# Altium project 1XGSH00.PrjPCB
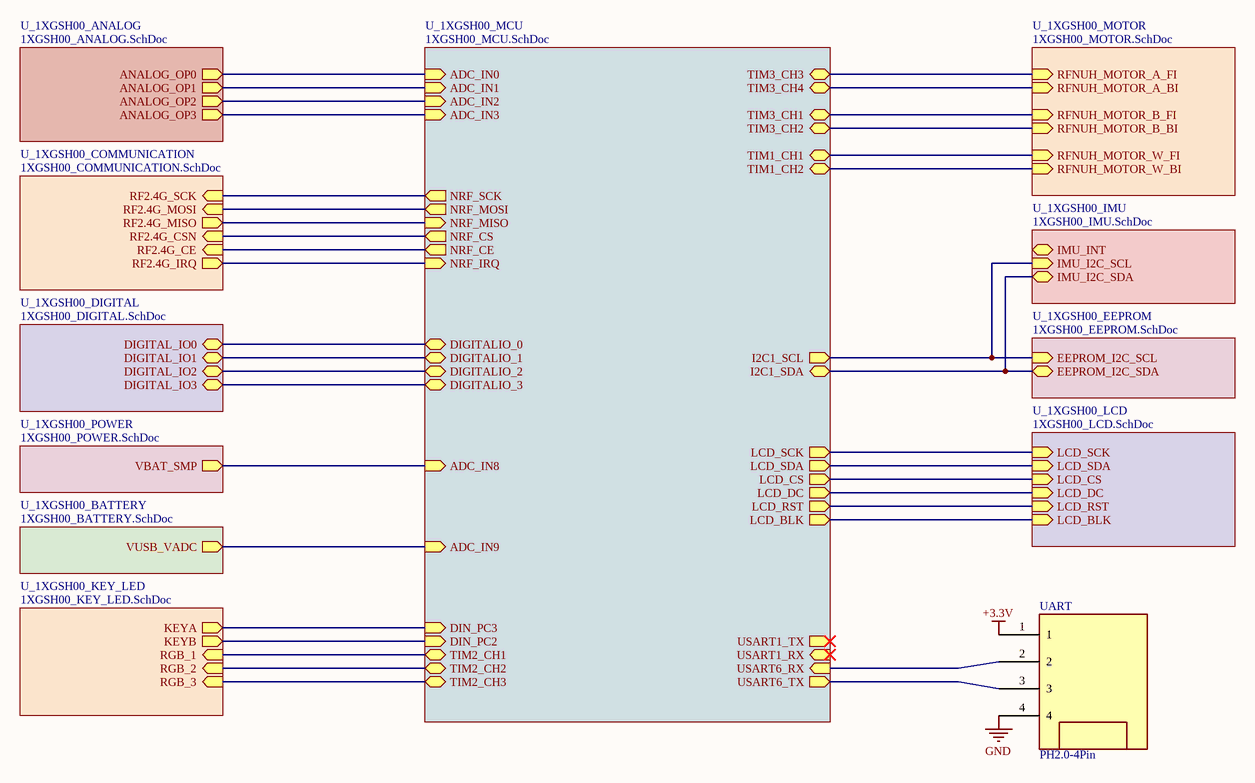
[diagram p0: 1XGSH00.SchDoc]
12 sheets, 178 parts. Net scope: hierarchical (ports join the sheet entries above them; power ports are global).
Board file: Copy of 1XGSH00_197.PcbDoc
Sheets:
  1XGSH00.SchDoc
    U_1XGSH00_ANALOG = 1XGSH00_ANALOG.SchDoc
    U_1XGSH00_BATTERY = 1XGSH00_BATTERY.SchDoc
    U_1XGSH00_COMMUNICATION = 1XGSH00_COMMUNICATION.SchDoc
    U_1XGSH00_DIGITAL = 1XGSH00_DIGITAL.SchDoc
    U_1XGSH00_MCU = 1XGSH00_MCU.SchDoc
    U_1XGSH00_POWER = 1XGSH00_POWER.SchDoc
    U_1XGSH00_MOTOR = 1XGSH00_MOTOR.SchDoc
    U_1XGSH00_IMU = 1XGSH00_IMU.SchDoc
    U_1XGSH00_EEPROM = 1XGSH00_EEPROM.SchDoc
    U_1XGSH00_KEY_LED = 1XGSH00_KEY_LED.SchDoc
    U_1XGSH00_LCD = 1XGSH00_LCD.SchDoc

## Sheet 1XGSH00.SchDoc
size A4

### Parts
UART  PH2.0-4Pin  [X1251WRS-04HF-LPSW]

### Sub-sheets
U_1XGSH00_ANALOG = 1XGSH00_ANALOG.SchDoc: ANALOG_OP0 (out), ANALOG_OP2 (out), ANALOG_OP3 (out), ANALOG_OP1 (out)
U_1XGSH00_BATTERY = 1XGSH00_BATTERY.SchDoc: VUSB_VADC (out)
U_1XGSH00_COMMUNICATION = 1XGSH00_COMMUNICATION.SchDoc: RF2.4G_SCK (in), RF2.4G_IRQ (out), RF2.4G_CE (in), RF2.4G_MISO (out), RF2.4G_MOSI (in), RF2.4G_CSN (in)
U_1XGSH00_DIGITAL = 1XGSH00_DIGITAL.SchDoc: DIGITAL_IO0 (bidir), DIGITAL_IO1 (bidir), DIGITAL_IO2 (bidir), DIGITAL_IO3 (bidir)
U_1XGSH00_EEPROM = 1XGSH00_EEPROM.SchDoc: EEPROM_I2C_SCL (in), EEPROM_I2C_SDA (bidir)
U_1XGSH00_IMU = 1XGSH00_IMU.SchDoc: IMU_I2C_SDA (bidir), IMU_I2C_SCL (in), IMU_INT (bidir)
U_1XGSH00_KEY_LED = 1XGSH00_KEY_LED.SchDoc: KEYA (out), KEYB (out), RGB_1 (in), RGB_2 (in), RGB_3 (in)
U_1XGSH00_LCD = 1XGSH00_LCD.SchDoc: LCD_SCK (in), LCD_SDA (in), LCD_DC (in), LCD_CS (in), LCD_RST (in), LCD_BLK (in)
U_1XGSH00_MCU = 1XGSH00_MCU.SchDoc: DIGITALIO_2 (bidir), DIGITALIO_3 (bidir), DIGITALIO_0 (bidir), DIGITALIO_1 (bidir), LCD_SCK (out), LCD_DC (out), LCD_BLK (out), LCD_SDA (out), LCD_CS (out), LCD_RST (out), TIM3_CH1 (bidir), ADC_IN8 (in), ADC_IN2 (in), NRF_CS (out), NRF_MISO (in), USART6_TX (out), TIM3_CH4 (bidir), USART1_RX (in), USART1_TX (out), TIM3_CH2 (bidir), TIM1_CH2 (bidir), TIM1_CH1 (bidir), I2C1_SCL (out), I2C1_SDA (bidir), ADC_IN3 (in), USART6_RX (in), TIM3_CH3 (bidir), TIM2_CH2 (bidir), NRF_CE (out), ADC_IN1 (in), NRF_IRQ (in), ADC_IN0 (in), NRF_SCK (out), NRF_MOSI (out), ADC_IN9 (in), TIM2_CH1 (bidir), TIM2_CH3 (bidir), DIN_PC2 (in), DIN_PC3 (in)
U_1XGSH00_MOTOR = 1XGSH00_MOTOR.SchDoc: RFNUH_MOTOR_W_BI (in), RFNUH_MOTOR_B_FI (in), RFNUH_MOTOR_A_FI (in), RFNUH_MOTOR_A_BI (in), RFNUH_MOTOR_W_FI (in), RFNUH_MOTOR_B_BI (in)
U_1XGSH00_POWER = 1XGSH00_POWER.SchDoc: VBAT_SMP (out)

### Nets
+3.3V: UART.1
GND: UART.4
I2C_SCL: sheet U_1XGSH00_MCU/I2C1_SCL, sheet U_1XGSH00_IMU/IMU_I2C_SCL, sheet U_1XGSH00_EEPROM/EEPROM_I2C_SCL
I2C_SDA: sheet U_1XGSH00_MCU/I2C1_SDA, sheet U_1XGSH00_IMU/IMU_I2C_SDA, sheet U_1XGSH00_EEPROM/EEPROM_I2C_SDA
MABI: sheet U_1XGSH00_MCU/TIM3_CH4, sheet U_1XGSH00_MOTOR/RFNUH_MOTOR_A_BI
MAFI: sheet U_1XGSH00_MCU/TIM3_CH3, sheet U_1XGSH00_MOTOR/RFNUH_MOTOR_A_FI
MBBI: sheet U_1XGSH00_MCU/TIM3_CH2, sheet U_1XGSH00_MOTOR/RFNUH_MOTOR_B_BI
MBFI: sheet U_1XGSH00_MCU/TIM3_CH1, sheet U_1XGSH00_MOTOR/RFNUH_MOTOR_B_FI
MCU_ADC0: sheet U_1XGSH00_ANALOG/ANALOG_OP0, sheet U_1XGSH00_MCU/ADC_IN0
MCU_ADC1: sheet U_1XGSH00_ANALOG/ANALOG_OP1, sheet U_1XGSH00_MCU/ADC_IN1
MCU_ADC2: sheet U_1XGSH00_ANALOG/ANALOG_OP2, sheet U_1XGSH00_MCU/ADC_IN2
MCU_ADC3: sheet U_1XGSH00_ANALOG/ANALOG_OP3, sheet U_1XGSH00_MCU/ADC_IN3
MWBI: sheet U_1XGSH00_MCU/TIM1_CH2, sheet U_1XGSH00_MOTOR/RFNUH_MOTOR_W_BI
MWFI: sheet U_1XGSH00_MCU/TIM1_CH1, sheet U_1XGSH00_MOTOR/RFNUH_MOTOR_W_FI
RF_CE: sheet U_1XGSH00_COMMUNICATION/RF2.4G_CE, sheet U_1XGSH00_MCU/NRF_CE
RF_IRQ: sheet U_1XGSH00_COMMUNICATION/RF2.4G_IRQ, sheet U_1XGSH00_MCU/NRF_IRQ
SPI_CLK: sheet U_1XGSH00_COMMUNICATION/RF2.4G_SCK, sheet U_1XGSH00_MCU/NRF_SCK
SPI_CS: sheet U_1XGSH00_COMMUNICATION/RF2.4G_CSN, sheet U_1XGSH00_MCU/NRF_CS
SPI_MISO: sheet U_1XGSH00_COMMUNICATION/RF2.4G_MISO, sheet U_1XGSH00_MCU/NRF_MISO
SPI_MOSI: sheet U_1XGSH00_COMMUNICATION/RF2.4G_MOSI, sheet U_1XGSH00_MCU/NRF_MOSI
USB_SMP: sheet U_1XGSH00_BATTERY/VUSB_VADC, sheet U_1XGSH00_MCU/ADC_IN9
VBAT_SMP: sheet U_1XGSH00_MCU/ADC_IN8, sheet U_1XGSH00_POWER/VBAT_SMP
NetC51#2_2: sheet U_1XGSH00_MCU/DIN_PC3, sheet U_1XGSH00_KEY_LED/KEYA
NetC52#2_2: sheet U_1XGSH00_MCU/DIN_PC2, sheet U_1XGSH00_KEY_LED/KEYB
NetJCON_3: sheet U_1XGSH00_MCU/LCD_SCK, sheet U_1XGSH00_LCD/LCD_SCK
NetJCON_4: sheet U_1XGSH00_MCU/LCD_SDA, sheet U_1XGSH00_LCD/LCD_SDA
NetJCON_5: sheet U_1XGSH00_MCU/LCD_DC, sheet U_1XGSH00_LCD/LCD_DC
NetJCON_6: sheet U_1XGSH00_MCU/LCD_CS, sheet U_1XGSH00_LCD/LCD_CS
NetJCON_7: sheet U_1XGSH00_MCU/LCD_RST, sheet U_1XGSH00_LCD/LCD_RST
NetJCON_8: sheet U_1XGSH00_MCU/LCD_BLK, sheet U_1XGSH00_LCD/LCD_BLK
NetQ2_1: sheet U_1XGSH00_MCU/TIM2_CH1, sheet U_1XGSH00_KEY_LED/RGB_1
NetQ3_1: sheet U_1XGSH00_MCU/TIM2_CH2, sheet U_1XGSH00_KEY_LED/RGB_2
NetQ4_1: sheet U_1XGSH00_MCU/TIM2_CH3, sheet U_1XGSH00_KEY_LED/RGB_3
NetR37_2: sheet U_1XGSH00_DIGITAL/DIGITAL_IO0, sheet U_1XGSH00_MCU/DIGITALIO_0
NetR38_2: sheet U_1XGSH00_DIGITAL/DIGITAL_IO1, sheet U_1XGSH00_MCU/DIGITALIO_1
NetR39_2: sheet U_1XGSH00_DIGITAL/DIGITAL_IO2, sheet U_1XGSH00_MCU/DIGITALIO_2
NetR40_2: sheet U_1XGSH00_DIGITAL/DIGITAL_IO3, sheet U_1XGSH00_MCU/DIGITALIO_3
NetU1_37: UART.3 ; sheet U_1XGSH00_MCU/USART6_TX
NetU1_38: UART.2 ; sheet U_1XGSH00_MCU/USART6_RX

## Sheet 1XGSH00_ANALOG.SchDoc
size A4
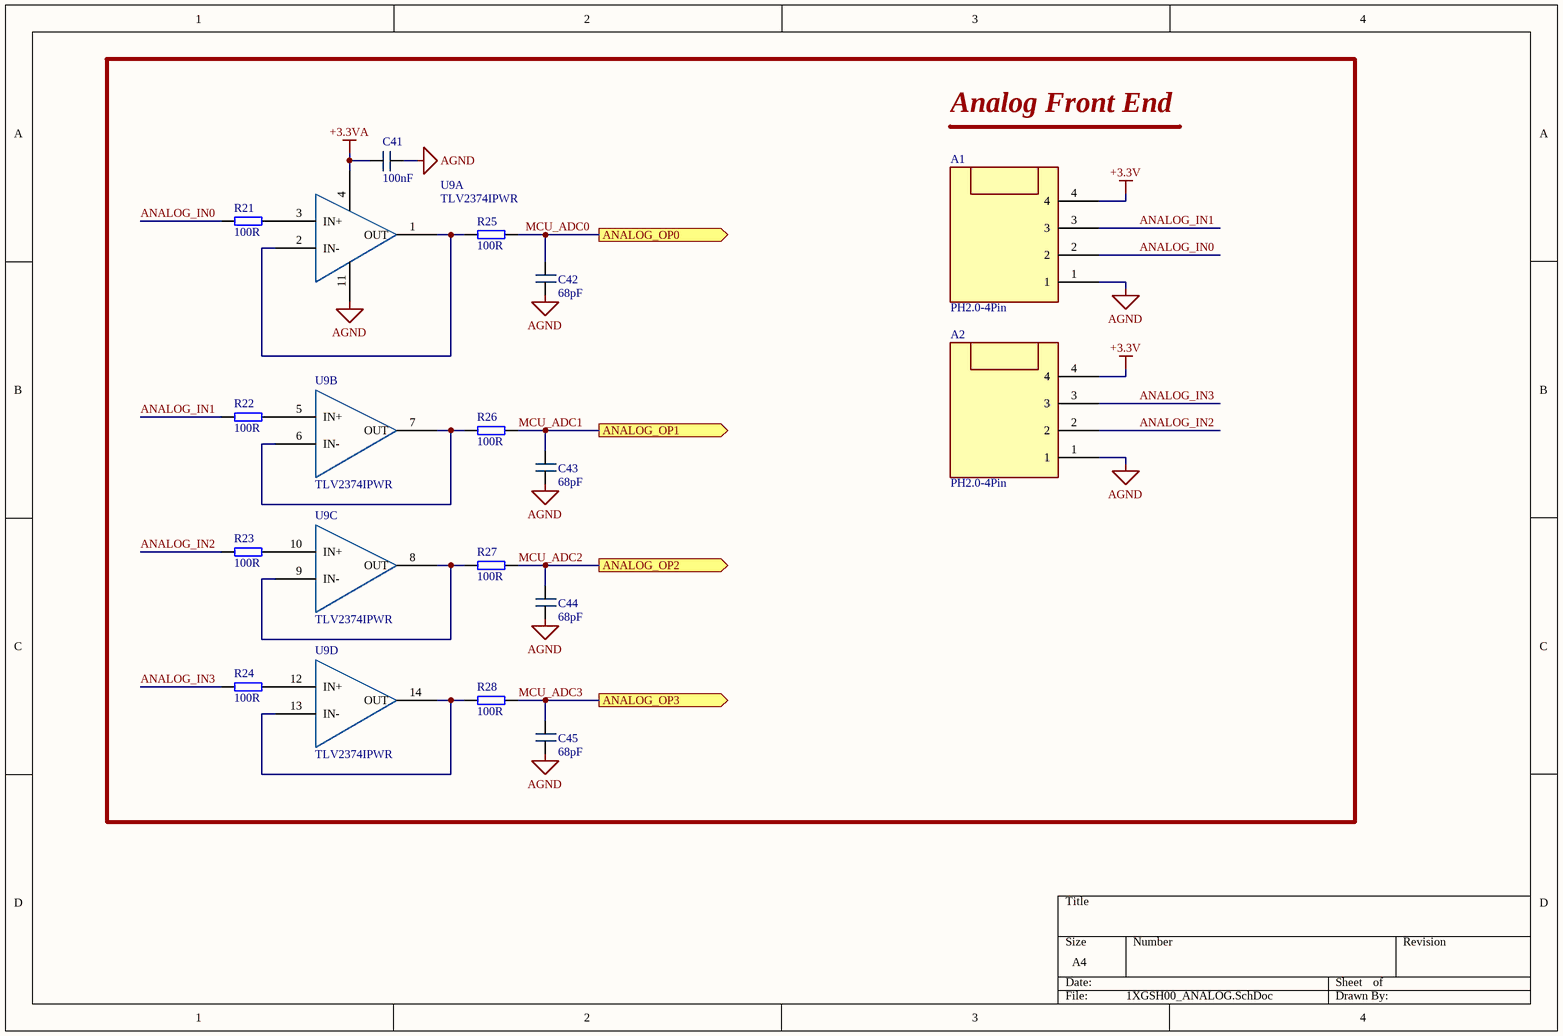
[diagram p1: 1XGSH00_ANALOG.SchDoc]

### Parts
A1  PH2.0-4Pin  [X1251WRS-04HF-LPSW]
A2  PH2.0-4Pin  [X1251WRS-04HF-LPSW]
C41  100nF  [0402_C]
C42  68pF  [0402_C]
C43  68pF  [0402_C]
C44  68pF  [0402_C]
C45  68pF  [0402_C]
R21  100R  [0402_R]
R22  100R  [0402_R]
R23  100R  [0402_R]
R24  100R  [0402_R]
R25  100R  [0402_R]
R26  100R  [0402_R]
R27  100R  [0402_R]
R28  100R  [0402_R]
U9  TLV2374IPWR  [TSSOP-14]  (parts A,B,C,D of 4)

### Blocks framed on the sheet
Analog Front End: A1 A2 C41-C45 R21-R28 U9

### Ports
ANALOG_OP0 (out), ANALOG_OP1 (out), ANALOG_OP2 (out), ANALOG_OP3 (out)

### Nets
+3.3V: A1.4 A2.4
+3.3VA: C41.1(-) U9.4(VDD)
AGND: A1.1 A2.1 C41.2(-) C42.1(-) C43.1(-) C44.1(-) C45.1(-) U9.11(GND)
ANALOG_IN0: A1.2 R21.1
ANALOG_IN1: A1.3 R22.1
ANALOG_IN2: A2.2 R23.1
ANALOG_IN3: A2.3 R24.1
MCU_ADC0: C42.2(-) R25.2 ; port ANALOG_OP0
MCU_ADC1: C43.2(-) R26.2 ; port ANALOG_OP1
MCU_ADC2: C44.2(-) R27.2 ; port ANALOG_OP2
MCU_ADC3: C45.2(-) R28.2 ; port ANALOG_OP3
NetR21_2: R21.2 U9.3(IN+)
NetR22_2: R22.2 U9.5(IN+)
NetR23_2: R23.2 U9.10(IN+)
NetR24_2: R24.2 U9.12(IN+)
NetR25_1: R25.1 U9.1(OUT) U9.2(IN-)
NetR26_1: R26.1 U9.6(IN-) U9.7(OUT)
NetR27_1: R27.1 U9.8(OUT) U9.9(IN-)
NetR28_1: R28.1 U9.13(IN-) U9.14(OUT)

### Library data of the parts
C41-C45 = Capacitor
R21-R28 = Resistor: Value: 1K
U9 = TLV2374IPWR: 4 Channels OPAMP

## Sheet 1XGSH00_BATTERY.SchDoc
size A4
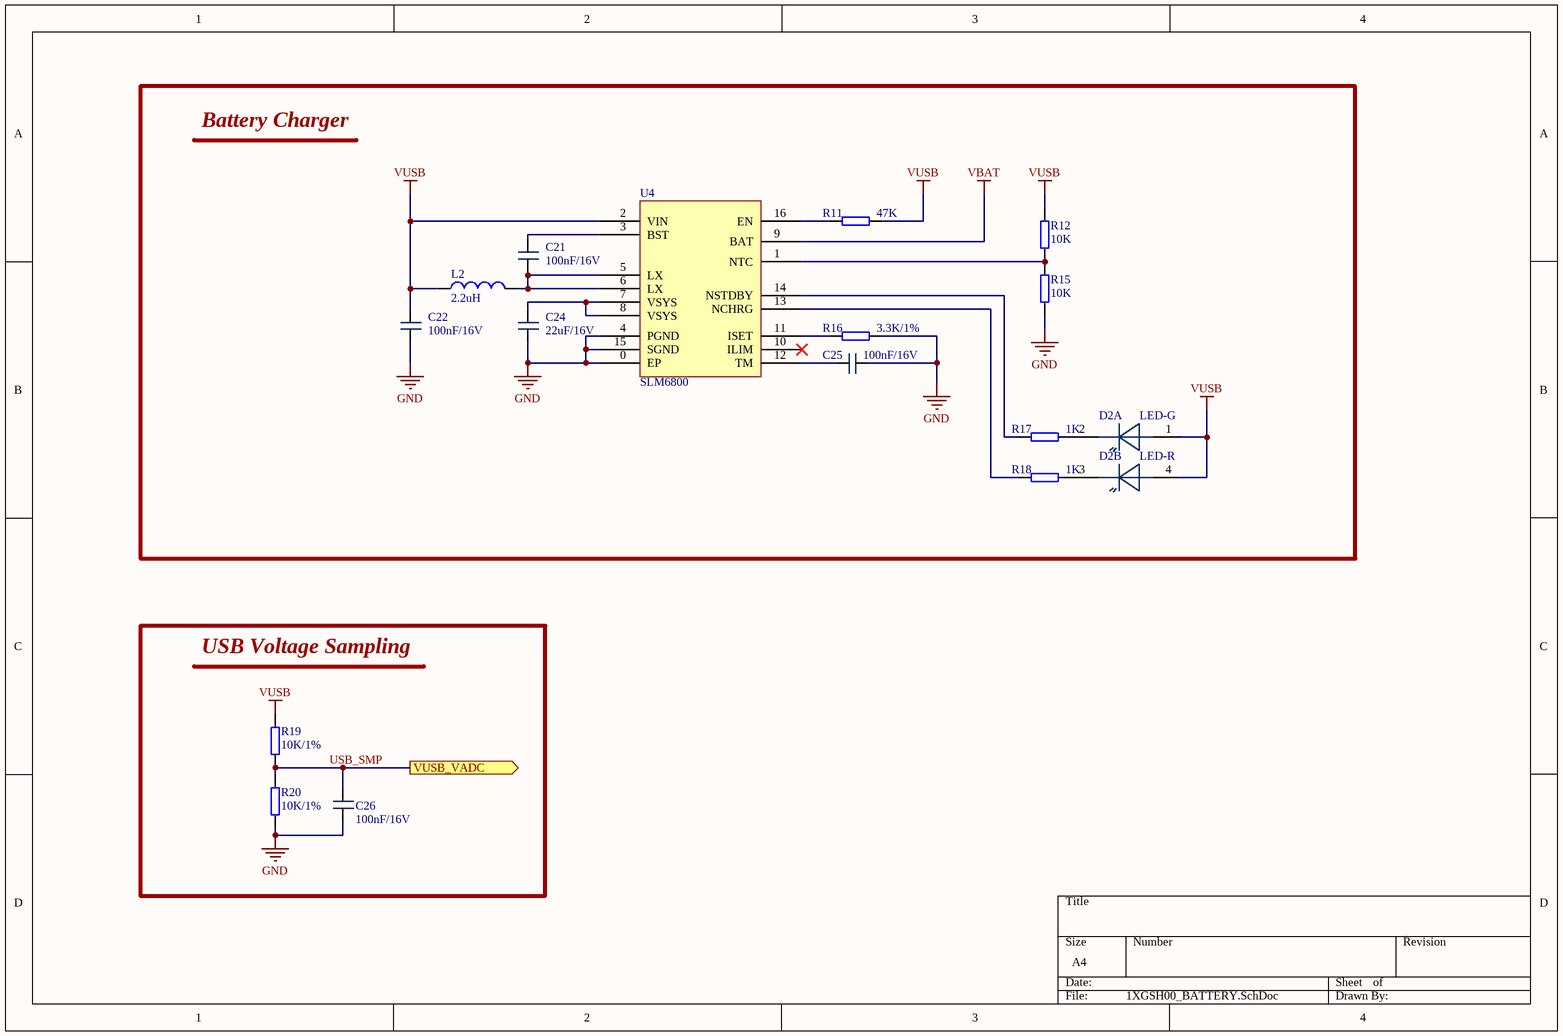
[diagram p2: 1XGSH00_BATTERY.SchDoc]

### Parts
C21  100nF/16V  [0805_C]
C22  100nF/16V  [0603_C]
C24  22uF/16V  [0805_C]
C25  100nF/16V  [0805_C]
C26  100nF/16V  [0402_C]
D2  LED-G  [3528_LED]  (parts A,B of 2)
L2  2.2uH  [INDUCTOR_4*4]
R11  47K  [0402_R]
R12  10K  [0402_R]
R15  10K  [0402_R]
R16  3.3K/1%  [0402_R]
R17  1K  [0402_R]
R18  1K  [0402_R]
R19  10K/1%  [0402_R]
R20  10K/1%  [0402_R]
U4  SLM6800  [QFN-16_L4.0-W4.0-P0.65-LS4.2-BL-EP]

### Blocks framed on the sheet
Battery Charger: C21 C22 C24 C25 D2 L2 R11 R12 R15-R18 U4
USB Voltage Sampling: C26 R19 R20

### Ports
VUSB_VADC (out)

### Nets
GND: C22.1(-) C24.1(-) C25.2(-) C26.1(-) R15.2 R16.2 R20.2 U4.0(EP) U4.4(PGND) U4.15(SGND)
VBAT: U4.9(BAT)
VUSB: C22.2(-) D2.1 D2.4 L2.1 R11.2 R12.1 R19.1 U4.2(VIN)
USB_SMP: C26.2(-) R19.2 R20.1 ; port VUSB_VADC
NetC21_1: C21.1(-) L2.2 U4.5(LX) U4.6(LX)
NetC21_2: C21.2(-) U4.3(BST)
NetC24_2: C24.2(-) U4.7(VSYS) U4.8(VSYS)
NetC25_1: C25.1(-) U4.12(TM)
NetD2_2: D2.2 R17.2
NetD2_3: D2.3 R18.2
NetR11_1: R11.1 U4.16(EN)
NetR12_2: R12.2 R15.1 U4.1(NTC)
NetR16_1: R16.1 U4.11(ISET)
NetR17_1: R17.1 U4.14(NSTDBY)
NetR18_1: R18.1 U4.13(NCHRG)

Not connected (* = marked no-connect by the designer): U4 10(ILIM)*

### Library data of the parts
C21 C22 C24-C26 = Capacitor
D2 = LED_Dual_2: Dual LED Single Package
L2 = Inductor: Code_IEC: 1005; Published: 8-Jun-2000; LatestRevisionDate: 29-May-2009; LatestRevisionNote: IPC-7351 Footprint Added.; PackageReference: 0402-A; Publisher: Altium Limited; PackageDescription: Chip Inductor; Code_JEITA: 0402
R11 R12 R15 R16 R19 R20 = Resistor: Value: 1K
R17 R18 = Resistor: Value: 1K
U4 = SLM6800: 5V 输入两节锂电池升压充电IC

## Sheet 1XGSH00_COMMUNICATION.SchDoc
size A3
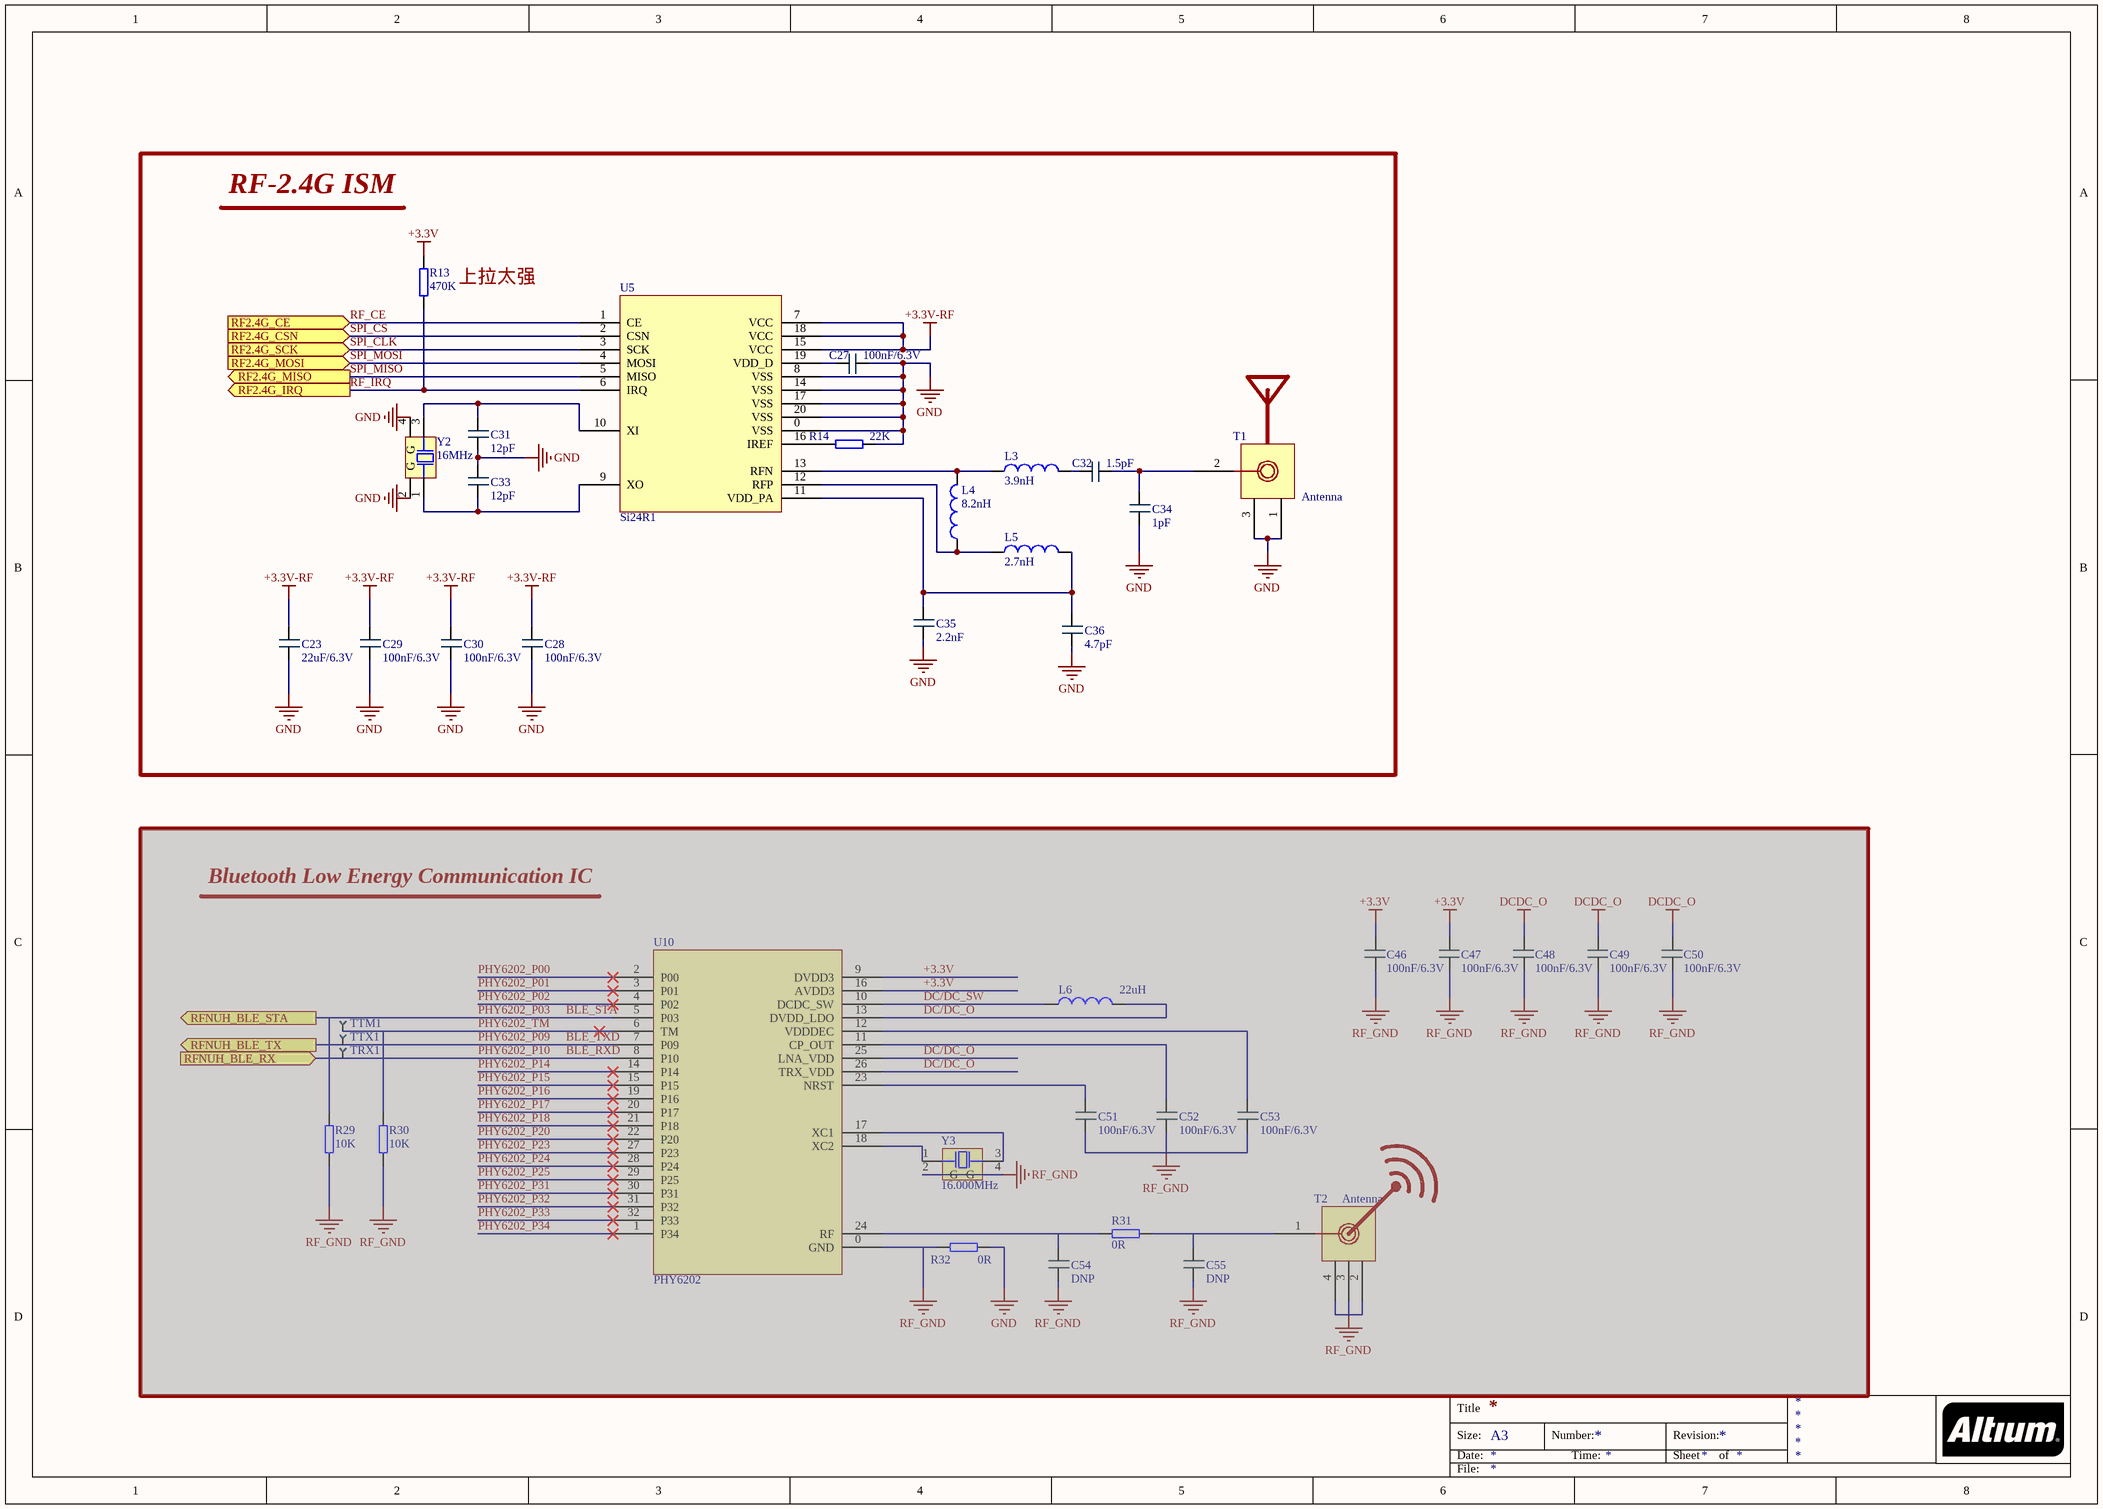
[diagram p3: 1XGSH00_COMMUNICATION.SchDoc]

### Parts
(Parts that share a designator on the sheet are numbered #1, #2 ... from top to bottom, then left to right.)
C23  22uF/6.3V  [0805_C]
C27  100nF/6.3V  [0402_C]
C28  100nF/6.3V  [0402_C]
C29  100nF/6.3V  [0402_C]
C30  100nF/6.3V  [0402_C]
C31  12pF  [0402_C]
C32  1.5pF  [0402_C]
C33  12pF  [0402_C]
C34  1pF  [0402_C]
C35  2.2nF  [0402_C]
C36  4.7pF  [0402_C]
C46#1  100nF/6.3V  [0402_C]  (masked out: inside a compile mask, not in the netlist)
C47#1  100nF/6.3V  [0402_C]  (masked out: inside a compile mask, not in the netlist)
C48#1  100nF/6.3V  [0402_C]  (masked out: inside a compile mask, not in the netlist)
C49#1  100nF/6.3V  [0402_C]  (masked out: inside a compile mask, not in the netlist)
C50#1  100nF/6.3V  [0402_C]  (masked out: inside a compile mask, not in the netlist)
C51#1  100nF/6.3V  [0402_C]  (masked out: inside a compile mask, not in the netlist)
C52#1  100nF/6.3V  [0402_C]  (masked out: inside a compile mask, not in the netlist)
C53#1  100nF/6.3V  [0402_C]  (masked out: inside a compile mask, not in the netlist)
C54#1  DNP  [0402_C]  (masked out: inside a compile mask, not in the netlist)
C55#1  DNP  [0402_C]  (masked out: inside a compile mask, not in the netlist)
L3  value 3.9nH  [0402_L]  (hidden comment: Inductor)
L4  value 8.2nH  [0402_L]  (hidden comment: Inductor)
L5  value 2.7nH  [0402_L]  (hidden comment: Inductor)
L6#1  22uH  [0805_L]  (masked out: inside a compile mask, not in the netlist)
R13  470K  [0402_R]
R14  22K  [0402_C]
R29#1  10K  [0805_R]  (masked out: inside a compile mask, not in the netlist)
R30#1  10K  [0805_R]  (masked out: inside a compile mask, not in the netlist)
R31#1  0R  [0402_R]  (masked out: inside a compile mask, not in the netlist)
R32#1  0R  [0402_R]  (masked out: inside a compile mask, not in the netlist)
T1  Antenna  [IPEX1-K501-29]
T2  Antenna  [IPEX1-K501-29]  (masked out: inside a compile mask, not in the netlist)
TRX1  TestPoint  [TEST POINT]  (value not drawn)  (masked out: inside a compile mask, not in the netlist)
TTM1  TestPoint  [TEST POINT]  (value not drawn)  (masked out: inside a compile mask, not in the netlist)
TTX1  TestPoint  [TEST POINT]  (value not drawn)  (masked out: inside a compile mask, not in the netlist)
U5  Si24R1  [QFN-20_4x4x05P]
U10#1  PHY6202  [QFN32]  (masked out: inside a compile mask, not in the netlist)
Y2  16MHz  [SMD-3225_4P]
Y3  16.000MHz  [SMD-3225_4P]  (masked out: inside a compile mask, not in the netlist)

### Blocks framed on the sheet
RF-2.4G ISM: C23 C27-C36 L3-L5 R13 R14 T1 U5 Y2
Bluetooth Low Energy Communication IC: C46#1 C47#1 C48#1 C49#1 C50#1 C51#1 C52#1 C53#1 C54#1 C55#1 L6#1 R29#1 R30#1 R31#1 R32#1 T2 TRX1 TTM1 TTX1 U10#1 Y3

### Ports
RF2.4G_CE (in), RF2.4G_CSN (in), RF2.4G_IRQ (out), RF2.4G_MISO (out), RF2.4G_MOSI (in), RF2.4G_SCK (in), RFNUH_BLE_RX (in), RFNUH_BLE_STA (out), RFNUH_BLE_TX (out)

### Nets
+3.3V: R13.1
+3.3V-RF: C23.2(-) C28.2(-) C29.2(-) C30.2(-) U5.7(VCC) U5.15(VCC) U5.18(VCC)
GND: C23.1(-) C27.2(-) C28.1(-) C29.1(-) C30.1(-) C31.1(-) C33.2(-) C34.1(-) C35.1(-) C36.1(-) R14.2 T1.1 T1.3 U5.0(VSS) U5.8(VSS) U5.14(VSS) U5.17(VSS) U5.20(VSS) Y2.2(G) Y2.4(G)
RF_CE: U5.1(CE) ; port RF2.4G_CE
RF_IRQ: R13.2 U5.6(IRQ) ; port RF2.4G_IRQ
SPI_CLK: U5.3(SCK) ; port RF2.4G_SCK
SPI_CS: U5.2(CSN) ; port RF2.4G_CSN
SPI_MISO: U5.5(MISO) ; port RF2.4G_MISO
SPI_MOSI: U5.4(MOSI) ; port RF2.4G_MOSI
NetC27_1: C27.1(-) U5.19(VDD_D)
NetC31_2: C31.2(-) U5.10(XI) Y2.3
NetC32_1: C32.1(-) L3.2
NetC32_2: C32.2(-) C34.2(-) T1.2
NetC33_1: C33.1(-) U5.9(XO) Y2.1
NetC35_2: C35.2(-) C36.2(-) L5.2 U5.11(VDD_PA)
NetL3_1: L3.1 L4.2 U5.13(RFN)
NetL4_1: L4.1 L5.1 U5.12(RFP)
NetR14_1: R14.1 U5.16(IREF)

### Notes on the sheet
- (near R13) 上拉太强
- Title
- Size:
- Date:
- A3
- Number:
- Time:
- Revision:
- Sheet
- of
- File:

### Library data of the parts
C23 C27-C36 C46#1 C47#1 C48#1 C49#1 C50#1 C51#1 C52#1 C53#1 C54#1 C55#1 = Capacitor
L3-L5 L6#1 = Inductor: Code_IEC: 1005; Published: 8-Jun-2000; LatestRevisionDate: 29-May-2009; LatestRevisionNote: IPC-7351 Footprint Added.; PackageReference: 0402-A; Publisher: Altium Limited; PackageDescription: Chip Inductor; Code_JEITA: 0402
R13 R14 R29#1 R30#1 R31#1 R32#1 = Resistor: Value: 1K
T1 = ANT_IPEX1: IPEX
T2 = ANT_IPEX: IPEX
TRX1 TTM1 TTX1 = Test Point
U5 = Si24R1: 超低功耗高性能 2.4GHz GFSK 无线收发芯片
U10#1 = PHY6202AQAA: BLE SOC
Y2 Y3 = XTAL_SMD

## Sheet 1XGSH00_DIGITAL.SchDoc
size A4
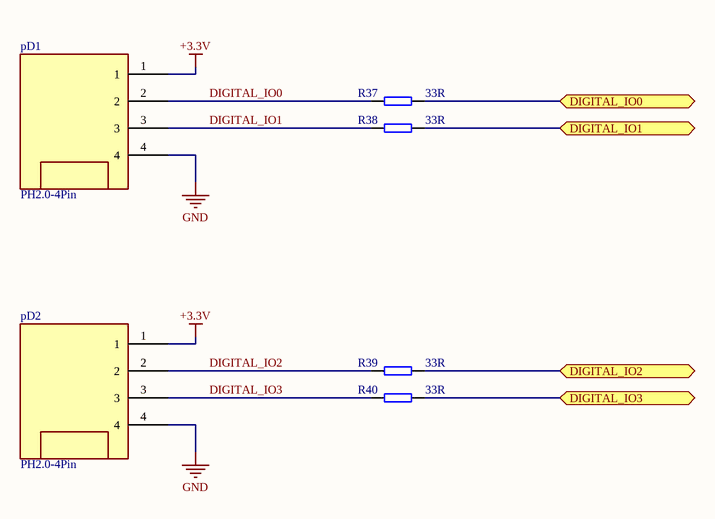
[diagram p4: 1XGSH00_DIGITAL.SchDoc]

### Parts
pD1  PH2.0-4Pin  [X1251WRS-04HF-LPSW]
pD2  PH2.0-4Pin  [X1251WRS-04HF-LPSW]
R37  33R  [0402_R]
R38  33R  [0402_R]
R39  33R  [0402_R]
R40  33R  [0402_R]

### Ports
DIGITAL_IO0 (bidir), DIGITAL_IO1 (bidir), DIGITAL_IO2 (bidir), DIGITAL_IO3 (bidir)

### Nets
+3.3V: pD1.1 pD2.1
GND: pD1.4 pD2.4
DIGITAL_IO0: pD1.2 R37.1
DIGITAL_IO1: pD1.3 R38.1
DIGITAL_IO2: pD2.2 R39.1
DIGITAL_IO3: pD2.3 R40.1
NetR37_2: R37.2 ; port DIGITAL_IO0
NetR38_2: R38.2 ; port DIGITAL_IO1
NetR39_2: R39.2 ; port DIGITAL_IO2
NetR40_2: R40.2 ; port DIGITAL_IO3

### Library data of the parts
R37-R40 = Resistor: Value: 1K

## Sheet 1XGSH00_MCU.SchDoc
size A3
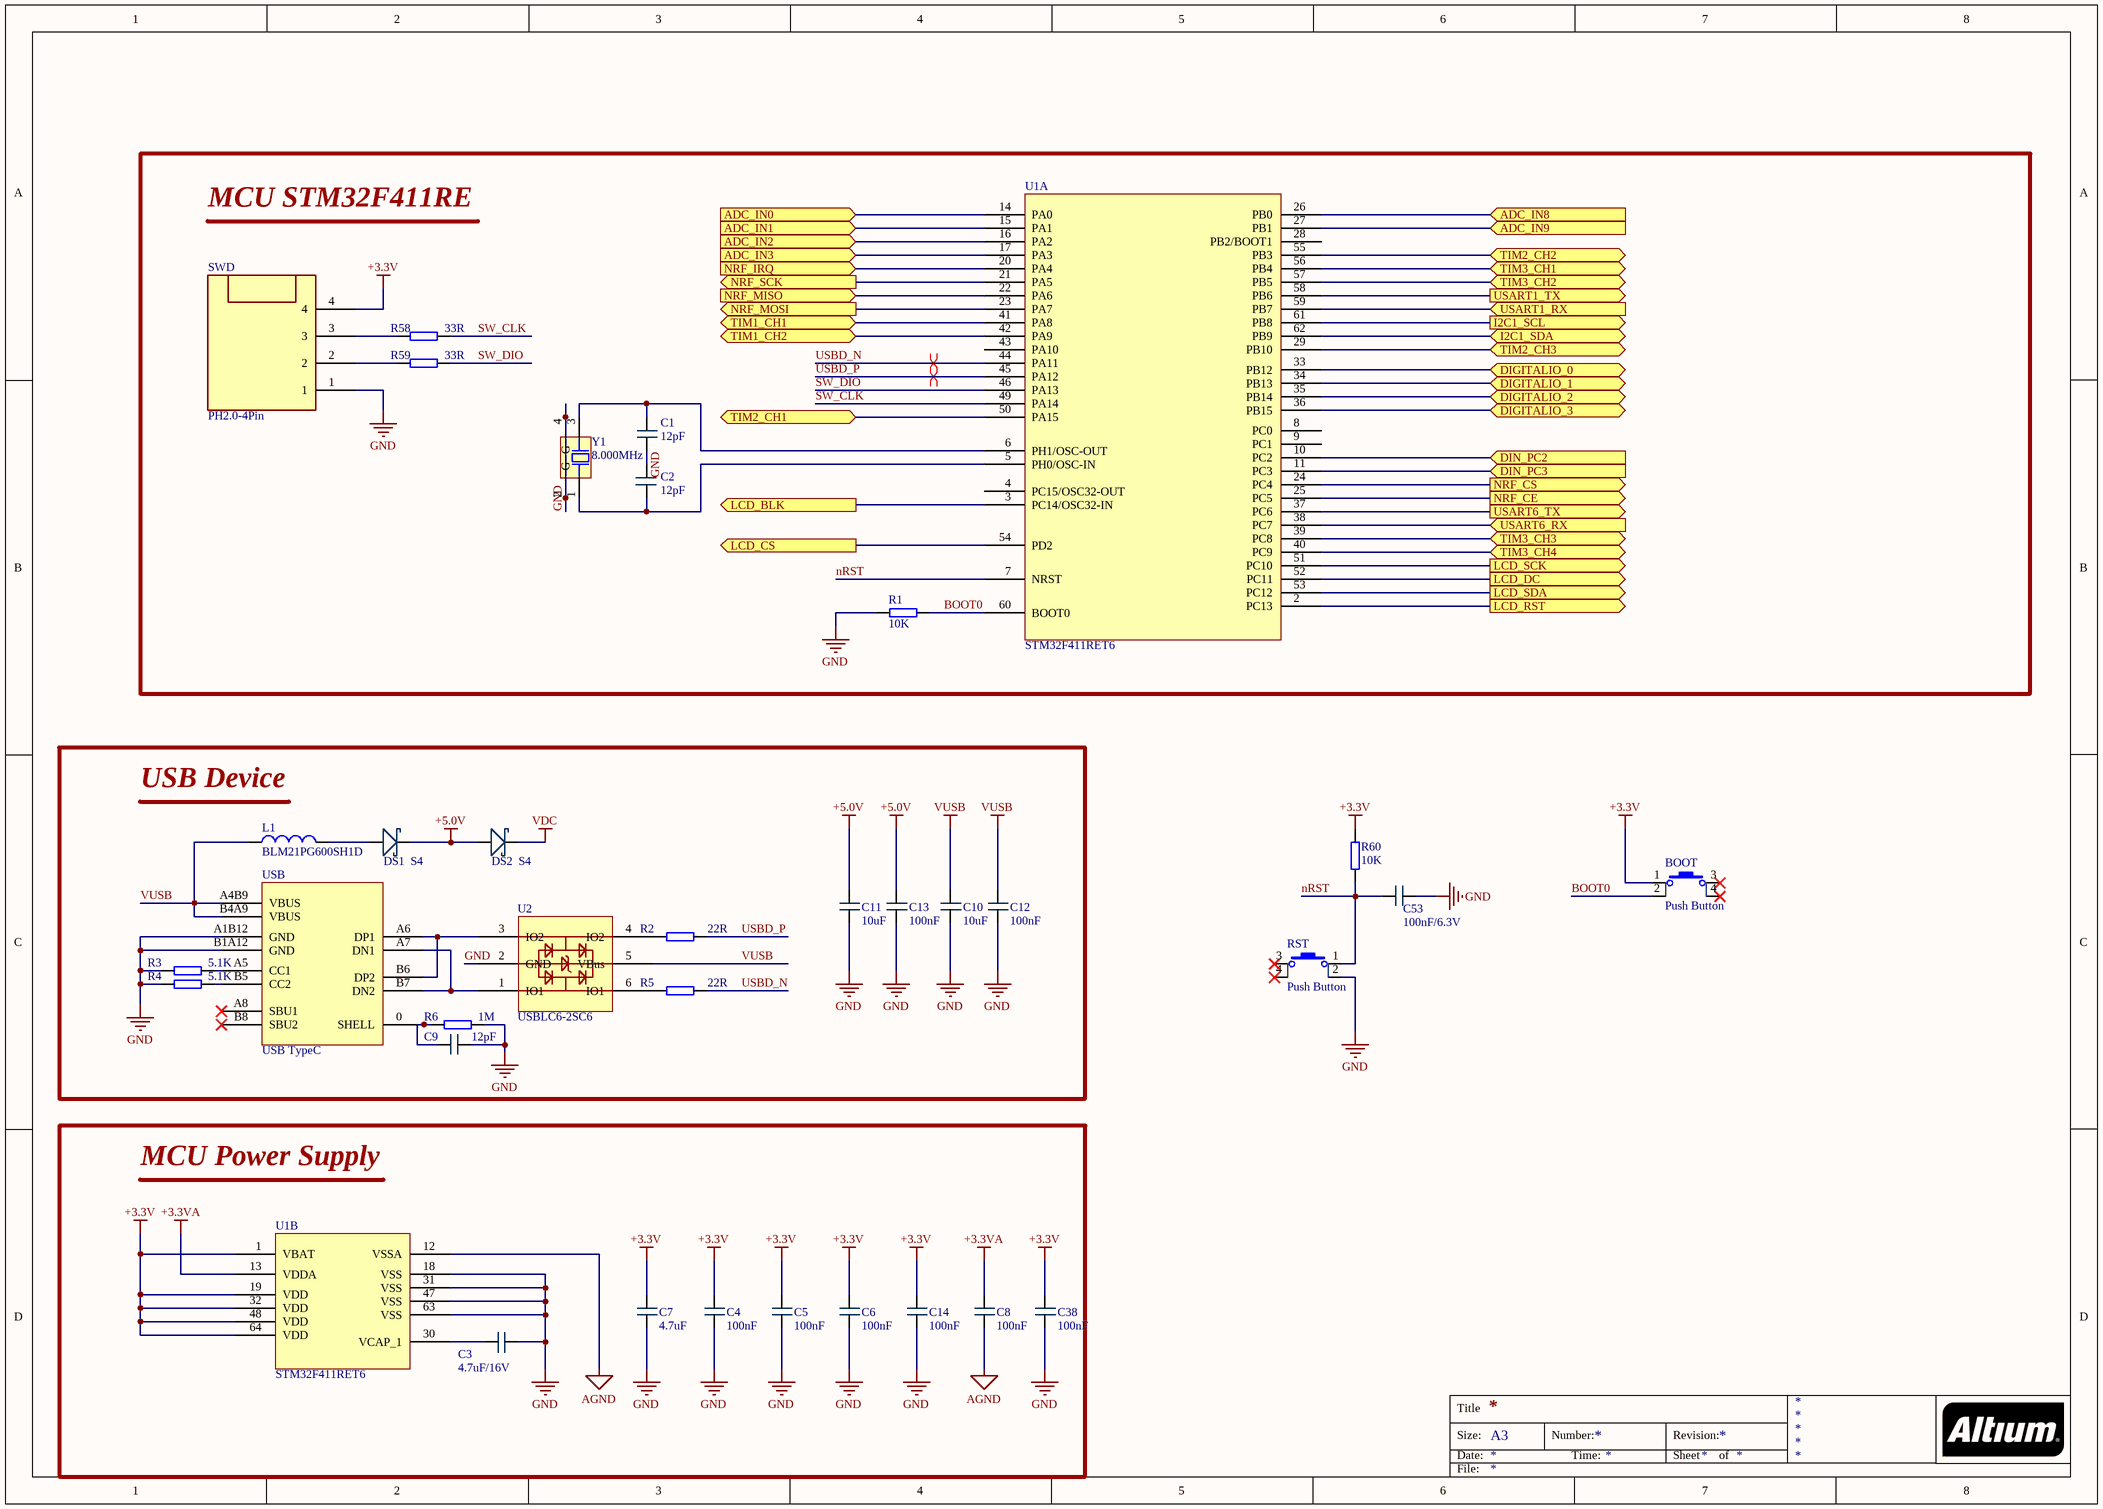
[diagram p5: 1XGSH00_MCU.SchDoc]

### Parts
(Parts that share a designator on the sheet are numbered #1, #2 ... from top to bottom, then left to right.)
BOOT  Push Button  [SW-SMD_TS-1010B-B-A]
C1  12pF  [0402_C]
C2  12pF  [0402_C]
C3  4.7uF/16V  [0603_C]
C4  100nF  [0402_C]
C5  100nF  [0402_C]
C6  100nF  [0402_C]
C7  4.7uF  [0603_C]
C8  100nF  [0402_C]
C9  12pF  [0603_C]
C10  10uF  [0603_C]
C11  10uF  [0603_C]
C12  100nF  [0402_C]
C13  100nF  [0402_C]
C14  100nF  [0402_C]
C38#1  100nF  [0402_C]
C53#2  100nF/6.3V  [0402_C]
DS1  S4  [SOD-323]
DS2  S4  [SOD-323]
L1  BLM21PG600SH1D  [0805_L]
R1  10K  [0402_R]
R2  22R  [0402_R]
R3  5.1K  [0402_R]
R4  5.1K  [0402_R]
R5  22R  [0402_R]
R6  1M  [0603_R]
R58  33R  [0402_R]
R59  33R  [0402_R]
R60  10K  [0402_R]
RST  Push Button  [SW-SMD_TS-1010B-B-A]
SWD  PH2.0-4Pin  [X1251WRS-04HF-LPSW]
U1  STM32F411RET6  [LQFP-64_10x10x05P]  (parts A,B of 2)
U2  USBLC6-2SC6  [SOT-23-6]
USB  USB TypeC  [USB_TypeC_16Pin (2.0)]
Y1  8.000MHz  [SMD-3225_4P]

### Blocks framed on the sheet
MCU STM32F411RE: C1 C2 R1 R58 R59 SWD U1 Y1
USB Device: C9-C13 DS1 DS2 L1 R2-R6 U2 USB
MCU Power Supply: C3-C8 C14 C38#1 U1

### Ports
ADC_IN0 (in), ADC_IN1 (in), ADC_IN2 (in), ADC_IN3 (in), ADC_IN8 (in), ADC_IN9 (in), DIGITALIO_0 (bidir), DIGITALIO_1 (bidir), DIGITALIO_2 (bidir), DIGITALIO_3 (bidir), DIN_PC2 (in), DIN_PC3 (in), I2C1_SCL (out), I2C1_SDA (bidir), LCD_BLK (out), LCD_CS (out), LCD_DC (out), LCD_RST (out), LCD_SCK (out), LCD_SDA (out), NRF_CE (out), NRF_CS (out), NRF_IRQ (in), NRF_MISO (in), NRF_MOSI (out), NRF_SCK (out), TIM1_CH1 (bidir), TIM1_CH2 (bidir), TIM2_CH1 (bidir), TIM2_CH2 (bidir), TIM2_CH3 (bidir), TIM3_CH1 (bidir), TIM3_CH2 (bidir), TIM3_CH3 (bidir), TIM3_CH4 (bidir), USART1_RX (in), USART1_TX (out), USART6_RX (in), USART6_TX (out)

### Nets
+3.3V: BOOT.1 C4.2(-) C5.2(-) C6.2(-) C7.2(-) C14.2(-) C38#1.2(-) R60.1 SWD.4 U1.1(VBAT) U1.19(VDD) U1.32(VDD) U1.48(VDD) U1.64(VDD)
+3.3VA: C8.2(-) U1.13(VDDA)
+5.0V: C11.2(-) C13.2(-) DS1.2(-) DS2.1(-)
AGND: C8.1(-) U1.12(VSSA)
GND: C1.1(-) C2.1(-) C3.2(-) C4.1(-) C5.1(-) C6.1(-) C7.1(-) C9.1(-) C10.1(-) C11.1(-) C12.1(-) C13.1(-) C14.1(-) C38#1.1(-) C53#2.1(-) R1.1 R3.1 R4.1 R6.2 RST.2 SWD.1 U1.18(VSS) U1.31(VSS) U1.47(VSS) U1.63(VSS) U2.2(GND) USB.A1B12(GND) USB.B1A12(GND) Y1.2(G) Y1.4(G)
VDC: DS2.2(-)
VUSB: C10.2(-) C12.2(-) L1.1 U2.5(VBus) USB.A4B9(VBUS) USB.B4A9(VBUS)
BOOT0: BOOT.2 R1.2 U1.60(BOOT0)
I2C_SCL: U1.61(PB8) ; port I2C1_SCL
I2C_SDA: U1.62(PB9) ; port I2C1_SDA
MABI: U1.40(PC9) ; port TIM3_CH4
MAFI: U1.39(PC8) ; port TIM3_CH3
MBBI: U1.57(PB5) ; port TIM3_CH2
MBFI: U1.56(PB4) ; port TIM3_CH1
MCU_ADC0: U1.14(PA0) ; port ADC_IN0
MCU_ADC1: U1.15(PA1) ; port ADC_IN1
MCU_ADC2: U1.16(PA2) ; port ADC_IN2
MCU_ADC3: U1.17(PA3) ; port ADC_IN3
MWBI: U1.42(PA9) ; port TIM1_CH2
MWFI: U1.41(PA8) ; port TIM1_CH1
nRST: C53#2.2(-) R60.2 RST.1 U1.7(NRST)
RF_CE: U1.25(PC5) ; port NRF_CE
RF_IRQ: U1.20(PA4) ; port NRF_IRQ
SPI_CLK: U1.21(PA5) ; port NRF_SCK
SPI_CS: U1.24(PC4) ; port NRF_CS
SPI_MISO: U1.22(PA6) ; port NRF_MISO
SPI_MOSI: U1.23(PA7) ; port NRF_MOSI
SW_CLK: R58.2 U1.49(PA14)
SW_DIO: R59.2 U1.46(PA13)
USB_SMP: U1.27(PB1) ; port ADC_IN9
USBD_N: R5.2 U1.44(PA11)
USBD_P: R2.2 U1.45(PA12)
VBAT_SMP: U1.26(PB0) ; port ADC_IN8
NetC1_2: C1.2(-) U1.6(PH1/OSC-OUT) Y1.3
NetC2_2: C2.2(-) U1.5(PH0/OSC-IN) Y1.1
NetC3_1: C3.1(-) U1.30(VCAP_1)
NetC9_2: C9.2(-) R6.1 USB.0(SHELL)
NetC51#2_2: U1.11(PC3) ; port DIN_PC3
NetC52#2_2: U1.10(PC2) ; port DIN_PC2
NetDS1_1: DS1.1(-) L1.2
NetJCON_3: U1.51(PC10) ; port LCD_SCK
NetJCON_4: U1.53(PC12) ; port LCD_SDA
NetJCON_5: U1.52(PC11) ; port LCD_DC
NetJCON_6: U1.54(PD2) ; port LCD_CS
NetJCON_7: U1.2(PC13) ; port LCD_RST
NetJCON_8: U1.3(PC14/OSC32-IN) ; port LCD_BLK
NetQ2_1: U1.50(PA15) ; port TIM2_CH1
NetQ3_1: U1.55(PB3) ; port TIM2_CH2
NetQ4_1: U1.29(PB10) ; port TIM2_CH3
NetR2_1: R2.1 U2.4(IO2)
NetR3_2: R3.2 USB.A5(CC1)
NetR4_2: R4.2 USB.B5(CC2)
NetR5_1: R5.1 U2.6(IO1)
NetR37_2: U1.33(PB12) ; port DIGITALIO_0
NetR38_2: U1.34(PB13) ; port DIGITALIO_1
NetR39_2: U1.35(PB14) ; port DIGITALIO_2
NetR40_2: U1.36(PB15) ; port DIGITALIO_3
NetR58_1: R58.1 SWD.3
NetR59_1: R59.1 SWD.2
NetU1_37: U1.37(PC6) ; port USART6_TX
NetU1_38: U1.38(PC7) ; port USART6_RX
NetU1_58: U1.58(PB6) ; port USART1_TX
NetU1_59: U1.59(PB7) ; port USART1_RX
NetU2_1: U2.1(IO1) USB.A7(DN1) USB.B7(DN2)
NetU2_3: U2.3(IO2) USB.A6(DP1) USB.B6(DP2)

Not connected (* = marked no-connect by the designer): BOOT 3* 4*; RST 3* 4*; U1 4(PC15/OSC32-OUT) 8(PC0) 9(PC1) 28(PB2/BOOT1) 43(PA10); USB A8(SBU1)* B8(SBU2)*

### Layout directives
differential pair: USBD_N, USBD_P

### Notes on the sheet
- Title
- Size:
- Date:
- A3
- Number:
- Time:
- Revision:
- Sheet
- of
- File:

### Library data of the parts
BOOT RST = SW-PB-SPST
C1-C14 C38#1 C53#2 = Capacitor
DS1 DS2 = Diode Scotty: Scotty Diode
L1 = Inductor: Code_IEC: 1005; Published: 8-Jun-2000; LatestRevisionDate: 29-May-2009; LatestRevisionNote: IPC-7351 Footprint Added.; PackageReference: 0402-A; Publisher: Altium Limited; PackageDescription: Chip Inductor; Code_JEITA: 0402
R1-R6 R58-R60 = Resistor: Value: 1K
U1 = STM32F411RET6: STM32 Series MCU
USB = USB TypeC 16Pin
Y1 = XTAL_SMD

## Sheet 1XGSH00_POWER.SchDoc
size A4
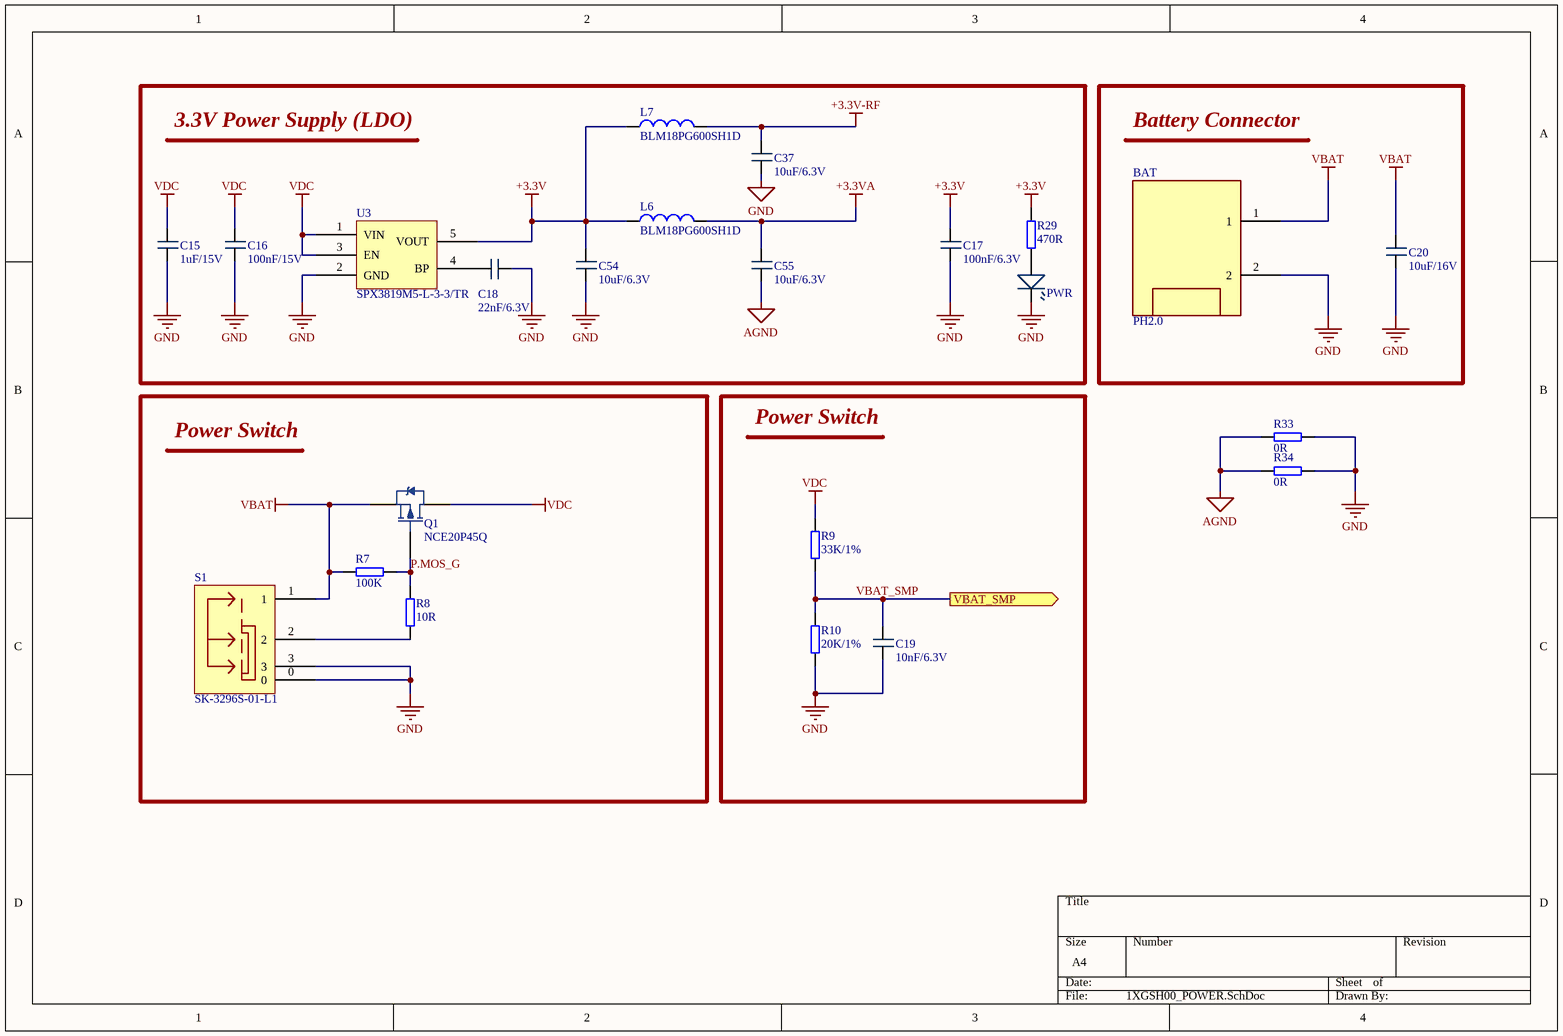
[diagram p6: 1XGSH00_POWER.SchDoc]

### Parts
(Parts that share a designator on the sheet are numbered #1, #2 ... from top to bottom, then left to right.)
BAT  PH2.0  [A2001WV-2P]
C15  1uF/15V  [0603_C]
C16  100nF/15V  [0402_C]
C17  100nF/6.3V  [0402_C]
C18  22nF/6.3V  [0402_C]
C19  10nF/6.3V  [0402_C]
C20  10uF/16V  [0805_C]
C37#1  10uF/6.3V  [0805_C]
C54#2  10uF/6.3V  [0603_C]
C55#2  10uF/6.3V  [0603_C]
L6#2  BLM18PG600SH1D  [0603_L]
L7  BLM18PG600SH1D  [0603_L]
PWR  LED  [0603_LED_S1]  (value not drawn)
Q1  NCE20P45Q  [DFN3.3*3.3]
R7  100K  [0402_R]
R8  10R  [0402_R]
R9  33K/1%  [0402_R]
R10  20K/1%  [0402_R]
R29#2  470R  [0402_R]
R33#1  0R  [0603_R]
R34#1  0R  [0603_R]
S1  SK-3296S-01-L1  [SW-SMD_3P-SK-3296S-01-L1]
U3  SPX3819M5-L-3-3/TR  [SOT-23-5]

### Blocks framed on the sheet
3.3V Power Supply (LDO): C15-C18 C37#1 C54#2 C55#2 L6#2 L7 PWR R29#2 U3
Battery Connector: BAT C20
Power Switch: Q1 R7 R8 S1
Power Switch: C19 R9 R10

### Ports
VBAT_SMP (out)

### Nets
+3.3V: C17.2(-) C54#2.2(-) L6#2.1 L7.1 R29#2.1 U3.5(VOUT)
+3.3V-RF: C37#1.2(-) L7.2
+3.3VA: C55#2.2(-) L6#2.2
AGND: C55#2.1(-) R33#1.1 R34#1.1
GND: BAT.2 C15.1(-) C16.1(-) C17.1(-) C18.2(-) C19.1(-) C20.1(-) C37#1.1(-) C54#2.1(-) PWR.2 R10.2 R33#1.2 R34#1.2 S1.0 S1.3 U3.2(GND)
VBAT: BAT.1 C20.2(-) Q1.S R7.1 S1.1
VDC: C15.2(-) C16.2(-) Q1.D R9.1 U3.1(VIN) U3.3(EN)
P.MOS_G: Q1.G R7.2 R8.1
VBAT_SMP: C19.2(-) R9.2 R10.1 ; port VBAT_SMP
NetC18_1: C18.1(-) U3.4(BP)
NetPWR_1: PWR.1 R29#2.2
NetR8_2: R8.2 S1.2

### Library data of the parts
BAT = XH2.5: XH2.5 Connector
C15-C20 C37#1 C54#2 C55#2 = Capacitor
L6#2 L7 = Inductor: Code_IEC: 1005; Published: 8-Jun-2000; LatestRevisionDate: 29-May-2009; LatestRevisionNote: IPC-7351 Footprint Added.; PackageReference: 0402-A; Publisher: Altium Limited; PackageDescription: Chip Inductor; Code_JEITA: 0402
Q1 = NCE20P45Q: P-Channel MOSFET
R7-R10 R29#2 R33#1 R34#1 = Resistor: Value: 1K
S1 = SW_SPDT: SPDT Swtch Slide
U3 = RT9193: RT9193-LDO

## Sheet 1XGSH00_MOTOR.SchDoc
size A4
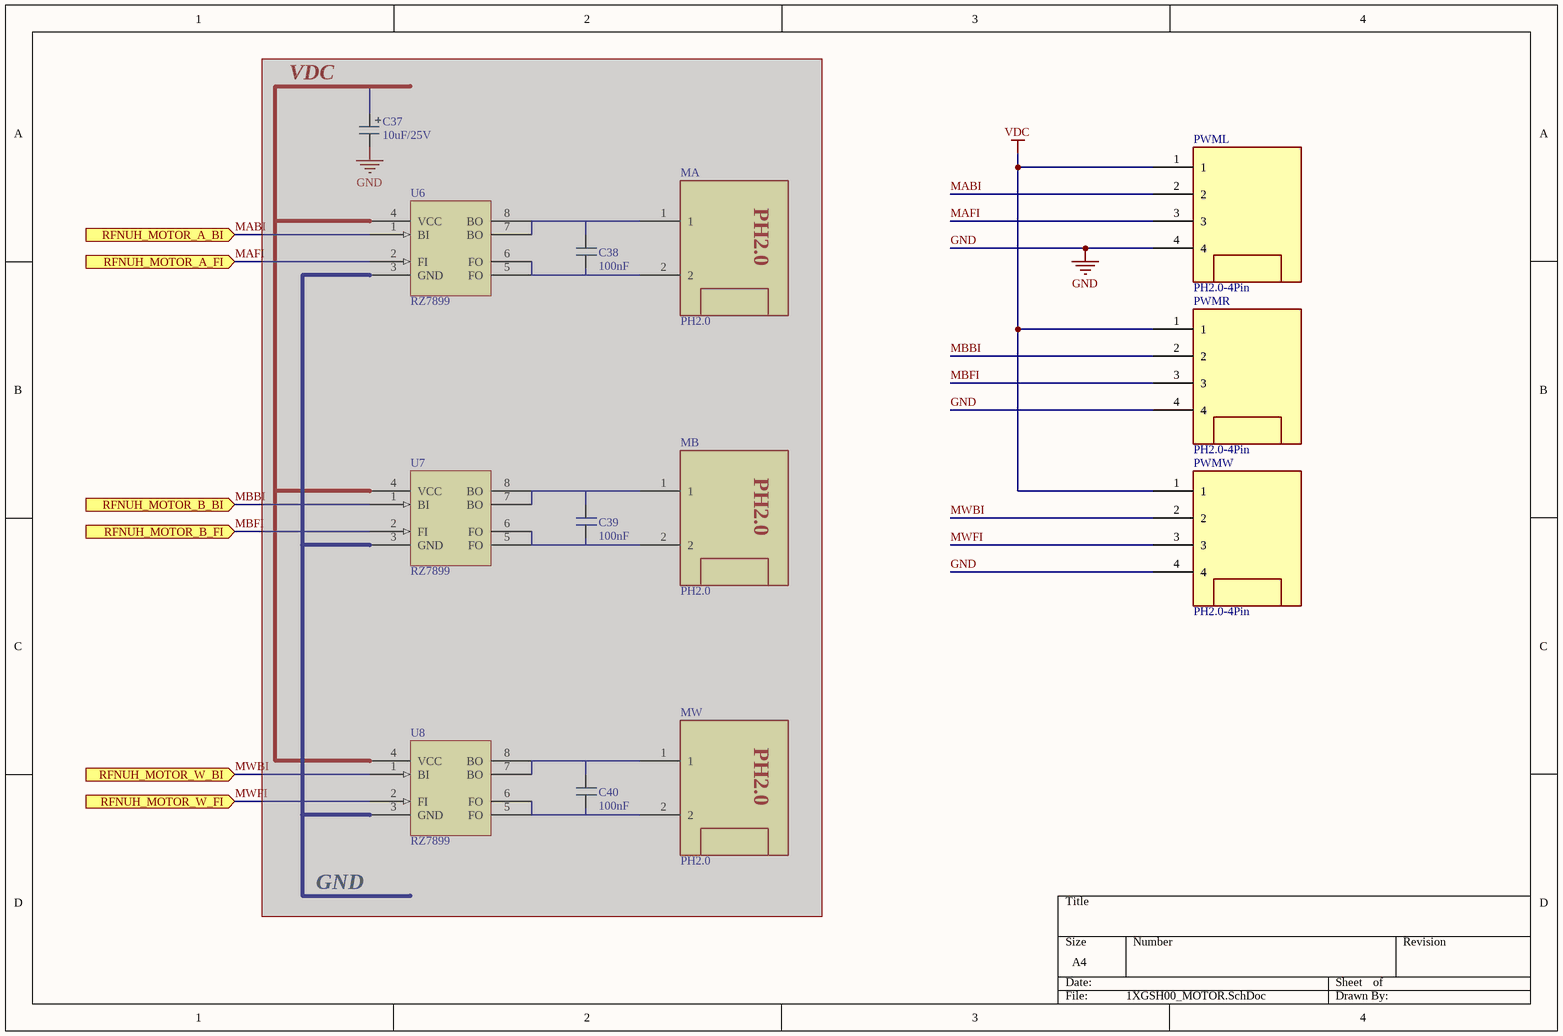
[diagram p7: 1XGSH00_MOTOR.SchDoc]

### Parts
(Parts that share a designator on the sheet are numbered #1, #2 ... from top to bottom, then left to right.)
C37#2  10uF/25V  [CASE-B_3528]  (masked out: inside a compile mask, not in the netlist)
C38#2  100nF  [0603_C]  (masked out: inside a compile mask, not in the netlist)
C39  100nF  [0603_C]  (masked out: inside a compile mask, not in the netlist)
C40  100nF  [0603_C]  (masked out: inside a compile mask, not in the netlist)
MA  PH2.0  [S2B-PH-SMT4]  (masked out: inside a compile mask, not in the netlist)
MB  PH2.0  [S2B-PH-SMT4]  (masked out: inside a compile mask, not in the netlist)
MW  PH2.0  [S2B-PH-SMT4]  (masked out: inside a compile mask, not in the netlist)
PWML  PH2.0-4Pin  [X1251WRS-04HF-LPSW]
PWMR  PH2.0-4Pin  [X1251WRS-04HF-LPSW]
PWMW  PH2.0-4Pin  [X1251WRS-04HF-LPSW]
U6  RZ7899  [SOP-8_150mil]  (masked out: inside a compile mask, not in the netlist)
U7  RZ7899  [SOP-8_150mil]  (masked out: inside a compile mask, not in the netlist)
U8  RZ7899  [SOP-8_150mil]  (masked out: inside a compile mask, not in the netlist)

### Ports
RFNUH_MOTOR_A_BI (in), RFNUH_MOTOR_A_FI (in), RFNUH_MOTOR_B_BI (in), RFNUH_MOTOR_B_FI (in), RFNUH_MOTOR_W_BI (in), RFNUH_MOTOR_W_FI (in)

### Nets
GND: PWML.4 PWMR.4 PWMW.4
VDC: PWML.1 PWMR.1 PWMW.1
MABI: PWML.2 ; port RFNUH_MOTOR_A_BI
MAFI: PWML.3 ; port RFNUH_MOTOR_A_FI
MBBI: PWMR.2 ; port RFNUH_MOTOR_B_BI
MBFI: PWMR.3 ; port RFNUH_MOTOR_B_FI
MWBI: PWMW.2 ; port RFNUH_MOTOR_W_BI
MWFI: PWMW.3 ; port RFNUH_MOTOR_W_FI

### Notes on the sheet
- PH2.0

### Library data of the parts
C37#2 = Capacitor-TANT: Capacitor
C38#2 C39 C40 = Capacitor
MA MB MW = XH2.5: XH2.5 Connector
U6-U8 = RZ7899: Low Power DC Motor Driver

## Sheet 1XGSH00_IMU.SchDoc
size A4
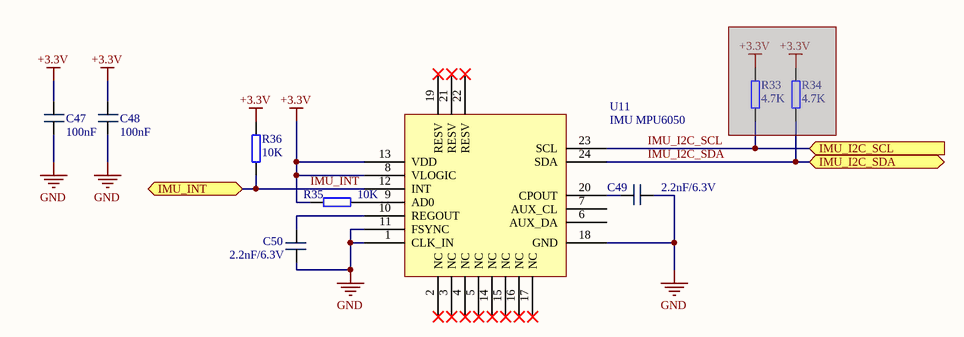
[diagram p8: 1XGSH00_IMU.SchDoc]

### Parts
(Parts that share a designator on the sheet are numbered #1, #2 ... from top to bottom, then left to right.)
C47#2  100nF  [0402_C]
C48#2  100nF  [0402_C]
C49#2  2.2nF/6.3V  [0402_C]
C50#2  2.2nF/6.3V  [0402_C]
R33#2  4.7K  [0402_R]  (masked out: inside a compile mask, not in the netlist)
R34#2  4.7K  [0402_R]  (masked out: inside a compile mask, not in the netlist)
R35  10K  [0402_R]
R36  10K  [0402_R]
U11  IMU MPU6050  [QFN-24_4x4x05P]

### Ports
IMU_I2C_SCL (in), IMU_I2C_SDA (bidir), IMU_INT (bidir)

### Nets
+3.3V: C47#2.2(-) C48#2.2(-) R35.1 R36.2 U11.8(VLOGIC) U11.13(VDD)
GND: C47#2.1(-) C48#2.1(-) C49#2.1(-) C50#2.2(-) U11.1(CLK_IN) U11.11(FSYNC) U11.18(GND)
IMU_I2C_SCL: U11.23(SCL) ; port IMU_I2C_SCL  [project net I2C_SCL]
IMU_I2C_SDA: U11.24(SDA) ; port IMU_I2C_SDA  [project net I2C_SDA]
IMU_INT: R36.1 U11.12(INT) ; port IMU_INT
NetC49#2_2: C49#2.2(-) U11.20(CPOUT)
NetC50#2_1: C50#2.1(-) U11.10(REGOUT)
NetR35_2: R35.2 U11.9(AD0)

Not connected (* = marked no-connect by the designer): U11 2(NC)* 3(NC)* 4(NC)* 5(NC)* 6(AUX_DA) 7(AUX_CL) 14(NC)* 15(NC)* 16(NC)* 17(NC)* 19(RESV)* 21(RESV)* 22(RESV)*

### Library data of the parts
C47#2 C48#2 C49#2 C50#2 = Capacitor
R33#2 R34#2 R35 R36 = Resistor: Value: 1K
U11 = MPU6050: GyroScope (IMU)

## Sheet 1XGSH00_EEPROM.SchDoc
size A4
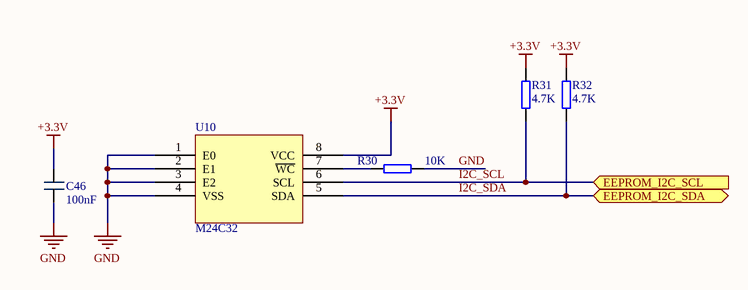
[diagram p9: 1XGSH00_EEPROM.SchDoc]

### Parts
(Parts that share a designator on the sheet are numbered #1, #2 ... from top to bottom, then left to right.)
C46#2  100nF  [0402_C]
R30#2  10K  [0402_R]
R31#2  4.7K  [0402_R]
R32#2  4.7K  [0402_R]
U10#2  M24C32  [UDFN-8L]

### Ports
EEPROM_I2C_SCL (in), EEPROM_I2C_SDA (bidir)

### Nets
+3.3V: C46#2.2(-) R31#2.1 R32#2.1 U10#2.8(VCC)
GND: C46#2.1(-) R30#2.2 U10#2.1(E0) U10#2.2(E1) U10#2.3(E2) U10#2.4(VSS)
I2C_SCL: R31#2.2 U10#2.6(SCL) ; port EEPROM_I2C_SCL
I2C_SDA: R32#2.2 U10#2.5(SDA) ; port EEPROM_I2C_SDA
NetR30#2_1: R30#2.1 U10#2.7(~{WC})

### Library data of the parts
C46#2 = Capacitor
R30#2 R31#2 R32#2 = Resistor: Value: 1K
U10#2 = M24C32: EEPROM

## Sheet 1XGSH00_KEY_LED.SchDoc
size A4
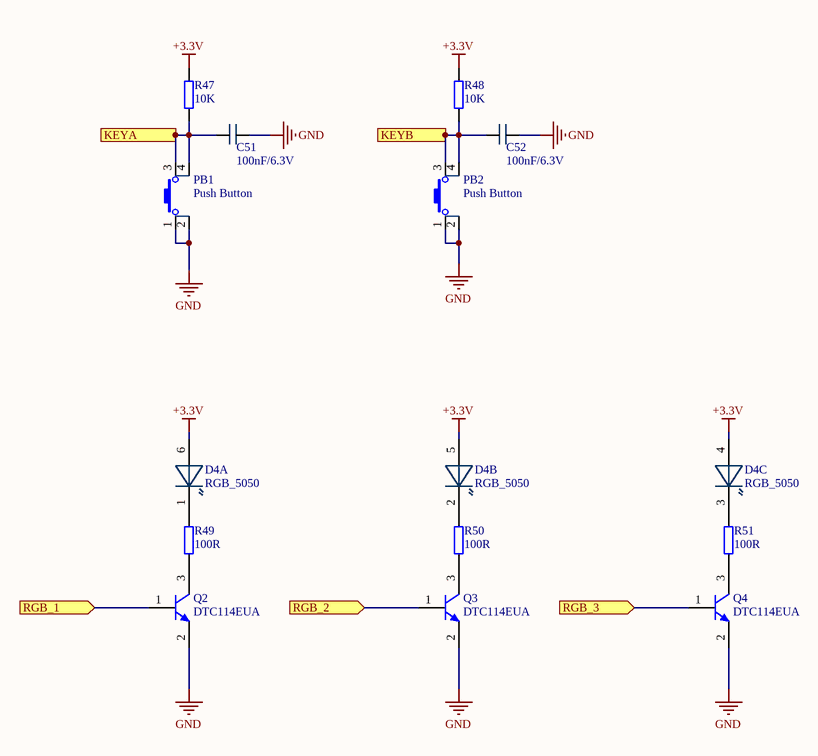
[diagram p10: 1XGSH00_KEY_LED.SchDoc]

### Parts
(Parts that share a designator on the sheet are numbered #1, #2 ... from top to bottom, then left to right.)
C51#2  100nF/6.3V  [0402_C]
C52#2  100nF/6.3V  [0402_C]
D4  RGB_5050  [LED_5050]  (parts A,B,C of 3)
PB1  Push Button  [SW-SMD_4P-L5.2-W5.2-P3.70-LS6.4]
PB2  Push Button  [SW-SMD_4P-L5.2-W5.2-P3.70-LS6.4]
Q2  DTC114EUA  [SC-70(SC-70-3)]
Q3  DTC114EUA  [SC-70(SC-70-3)]
Q4  DTC114EUA  [SC-70(SC-70-3)]
R47  10K  [0402_R]
R48  10K  [0402_R]
R49  100R  [0402_R]
R50  100R  [0402_R]
R51  100R  [0402_R]

### Ports
KEYA (out), KEYB (out), RGB_1 (in), RGB_2 (in), RGB_3 (in)

### Nets
+3.3V: D4.4(A3) D4.5(A2) D4.6(A1) R47.1 R48.1
GND: C51#2.1(-) C52#2.1(-) PB1.1 PB1.2 PB2.1 PB2.2 Q2.2(E) Q3.2(E) Q4.2(E)
NetC51#2_2: C51#2.2(-) PB1.3 PB1.4 R47.2 ; port KEYA
NetC52#2_2: C52#2.2(-) PB2.3 PB2.4 R48.2 ; port KEYB
NetD4_1: D4.1(K1) R49.1
NetD4_2: D4.2(K2) R50.1
NetD4_3: D4.3(K3) R51.1
NetQ2_1: Q2.1(B) ; port RGB_1
NetQ2_3: Q2.3(C) R49.2
NetQ3_1: Q3.1(B) ; port RGB_2
NetQ3_3: Q3.3(C) R50.2
NetQ4_1: Q4.1(B) ; port RGB_3
NetQ4_3: Q4.3(C) R51.2

### Library data of the parts
C51#2 C52#2 = Capacitor
D4 = RGB_5050: 5050 RGB LED
PB1 PB2 = SW-PB-SPST
Q2-Q4 = MMBT3904: NPN Bipolar Transistor; Published: 8-Jun-2000; LatestRevisionDate: 17-Jul-2002; LatestRevisionNote: Re-released for DXP Platform.; PackageReference: TO-226-AA; Publisher: Altium Limited; PackageDescription: TO, Flat Index; 3 In-Line, Axial Leads; Body Dia. 4.8mm; Leads 0.55 x 0.51 mm (max); Code_JEDEC: TO-226-AA
R47-R51 = Resistor: Value: 1K

## Sheet 1XGSH00_LCD.SchDoc
size A4
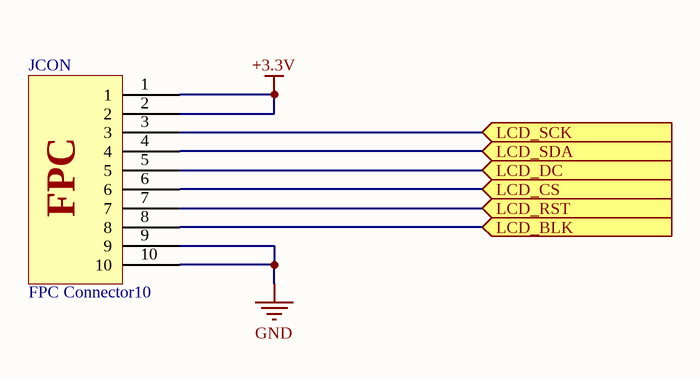
[diagram p11: 1XGSH00_LCD.SchDoc]

### Parts
JCON  FPC Connector10  [FPC-SMD_10P]

### Ports
LCD_BLK (in), LCD_CS (in), LCD_DC (in), LCD_RST (in), LCD_SCK (in), LCD_SDA (in)

### Nets
+3.3V: JCON.1 JCON.2
GND: JCON.9 JCON.10
NetJCON_3: JCON.3 ; port LCD_SCK
NetJCON_4: JCON.4 ; port LCD_SDA
NetJCON_5: JCON.5 ; port LCD_DC
NetJCON_6: JCON.6 ; port LCD_CS
NetJCON_7: JCON.7 ; port LCD_RST
NetJCON_8: JCON.8 ; port LCD_BLK

### Notes on the sheet
- (in symbol FPC Connector10) FPC

### Library data of the parts
JCON = FPC Connector10: FPC 0.5mm 14P

## Nets that join several sheets
+3.3V: 1XGSH00 (UART.1), 1XGSH00_ANALOG (A1.4 A2.4), 1XGSH00_COMMUNICATION (R13.1), 1XGSH00_DIGITAL (pD1.1 pD2.1), 1XGSH00_MCU (14 pins), 1XGSH00_POWER (6 pins), 1XGSH00_IMU (6 pins), 1XGSH00_EEPROM (C46#2.2 R31#2.1 R32#2.1 U10#2.8), 1XGSH00_KEY_LED (5 pins), 1XGSH00_LCD (JCON.1 JCON.2)
+3.3V-RF: 1XGSH00_COMMUNICATION (7 pins), 1XGSH00_POWER (C37#1.2 L7.2)
+3.3VA: 1XGSH00_ANALOG (C41.1 U9.4), 1XGSH00_MCU (C8.2 U1.13), 1XGSH00_POWER (C55#2.2 L6#2.2)
AGND: 1XGSH00_ANALOG (8 pins), 1XGSH00_MCU (C8.1 U1.12), 1XGSH00_POWER (C55#2.1 R33#1.1 R34#1.1)
GND: 1XGSH00 (UART.4), 1XGSH00_BATTERY (10 pins), 1XGSH00_COMMUNICATION (20 pins), 1XGSH00_DIGITAL (pD1.4 pD2.4), 1XGSH00_MCU (30 pins), 1XGSH00_POWER (16 pins), 1XGSH00_MOTOR (PWML.4 PWMR.4 PWMW.4), 1XGSH00_IMU (7 pins), 1XGSH00_EEPROM (6 pins), 1XGSH00_KEY_LED (9 pins), 1XGSH00_LCD (JCON.9 JCON.10)
VBAT: 1XGSH00_BATTERY (U4.9), 1XGSH00_POWER (5 pins)
VDC: 1XGSH00_MCU (DS2.2), 1XGSH00_POWER (6 pins), 1XGSH00_MOTOR (PWML.1 PWMR.1 PWMW.1)
VUSB: 1XGSH00_BATTERY (8 pins), 1XGSH00_MCU (6 pins)
I2C_SCL: 1XGSH00_MCU (U1.61), 1XGSH00_IMU (U11.23), 1XGSH00_EEPROM (R31#2.2 U10#2.6)
I2C_SDA: 1XGSH00_MCU (U1.62), 1XGSH00_IMU (U11.24), 1XGSH00_EEPROM (R32#2.2 U10#2.5)
MABI: 1XGSH00_MCU (U1.40), 1XGSH00_MOTOR (PWML.2)
MAFI: 1XGSH00_MCU (U1.39), 1XGSH00_MOTOR (PWML.3)
MBBI: 1XGSH00_MCU (U1.57), 1XGSH00_MOTOR (PWMR.2)
MBFI: 1XGSH00_MCU (U1.56), 1XGSH00_MOTOR (PWMR.3)
MCU_ADC0: 1XGSH00_ANALOG (C42.2 R25.2), 1XGSH00_MCU (U1.14)
MCU_ADC1: 1XGSH00_ANALOG (C43.2 R26.2), 1XGSH00_MCU (U1.15)
MCU_ADC2: 1XGSH00_ANALOG (C44.2 R27.2), 1XGSH00_MCU (U1.16)
MCU_ADC3: 1XGSH00_ANALOG (C45.2 R28.2), 1XGSH00_MCU (U1.17)
MWBI: 1XGSH00_MCU (U1.42), 1XGSH00_MOTOR (PWMW.2)
MWFI: 1XGSH00_MCU (U1.41), 1XGSH00_MOTOR (PWMW.3)
NetC51#2_2: 1XGSH00_MCU (U1.11), 1XGSH00_KEY_LED (C51#2.2 PB1.3 PB1.4 R47.2)
NetC52#2_2: 1XGSH00_MCU (U1.10), 1XGSH00_KEY_LED (C52#2.2 PB2.3 PB2.4 R48.2)
NetJCON_3: 1XGSH00_MCU (U1.51), 1XGSH00_LCD (JCON.3)
NetJCON_4: 1XGSH00_MCU (U1.53), 1XGSH00_LCD (JCON.4)
NetJCON_5: 1XGSH00_MCU (U1.52), 1XGSH00_LCD (JCON.5)
NetJCON_6: 1XGSH00_MCU (U1.54), 1XGSH00_LCD (JCON.6)
NetJCON_7: 1XGSH00_MCU (U1.2), 1XGSH00_LCD (JCON.7)
NetJCON_8: 1XGSH00_MCU (U1.3), 1XGSH00_LCD (JCON.8)
NetQ2_1: 1XGSH00_MCU (U1.50), 1XGSH00_KEY_LED (Q2.1)
NetQ3_1: 1XGSH00_MCU (U1.55), 1XGSH00_KEY_LED (Q3.1)
NetQ4_1: 1XGSH00_MCU (U1.29), 1XGSH00_KEY_LED (Q4.1)
NetR37_2: 1XGSH00_DIGITAL (R37.2), 1XGSH00_MCU (U1.33)
NetR38_2: 1XGSH00_DIGITAL (R38.2), 1XGSH00_MCU (U1.34)
NetR39_2: 1XGSH00_DIGITAL (R39.2), 1XGSH00_MCU (U1.35)
NetR40_2: 1XGSH00_DIGITAL (R40.2), 1XGSH00_MCU (U1.36)
NetU1_37: 1XGSH00 (UART.3), 1XGSH00_MCU (U1.37)
NetU1_38: 1XGSH00 (UART.2), 1XGSH00_MCU (U1.38)
RF_CE: 1XGSH00_COMMUNICATION (U5.1), 1XGSH00_MCU (U1.25)
RF_IRQ: 1XGSH00_COMMUNICATION (R13.2 U5.6), 1XGSH00_MCU (U1.20)
SPI_CLK: 1XGSH00_COMMUNICATION (U5.3), 1XGSH00_MCU (U1.21)
SPI_CS: 1XGSH00_COMMUNICATION (U5.2), 1XGSH00_MCU (U1.24)
SPI_MISO: 1XGSH00_COMMUNICATION (U5.5), 1XGSH00_MCU (U1.22)
SPI_MOSI: 1XGSH00_COMMUNICATION (U5.4), 1XGSH00_MCU (U1.23)
USB_SMP: 1XGSH00_BATTERY (C26.2 R19.2 R20.1), 1XGSH00_MCU (U1.27)
VBAT_SMP: 1XGSH00_MCU (U1.26), 1XGSH00_POWER (C19.2 R9.2 R10.1)